# EAGLE design OpIoT_jetson_v_1_4 (EAGLE 9.6.2)
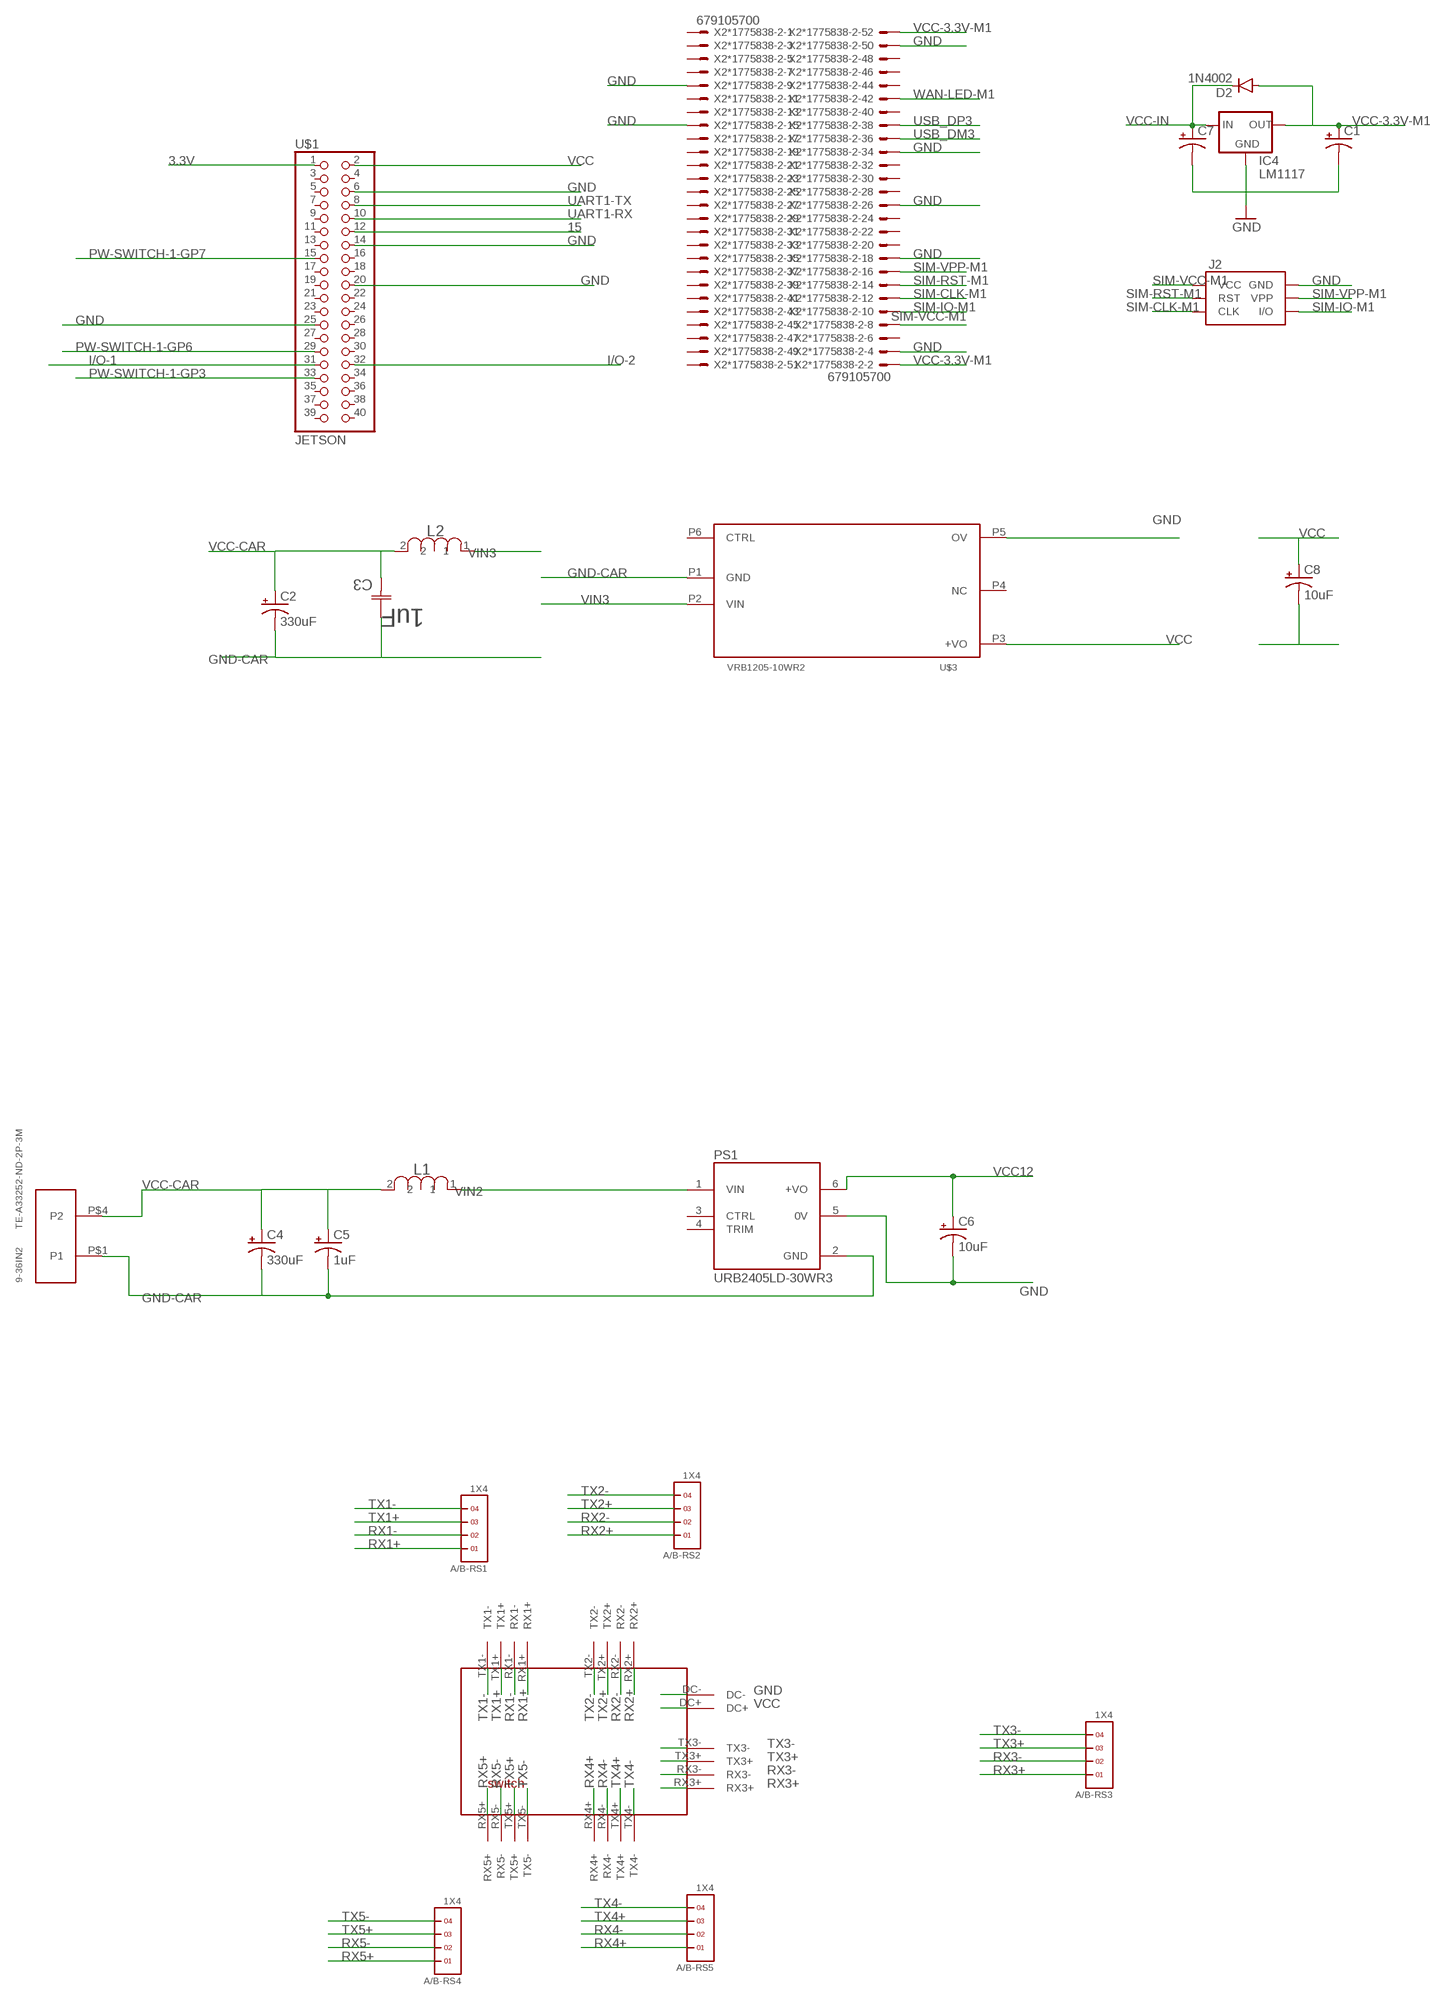
[diagram p0: schematic, sheet 1, part 1 of 2]
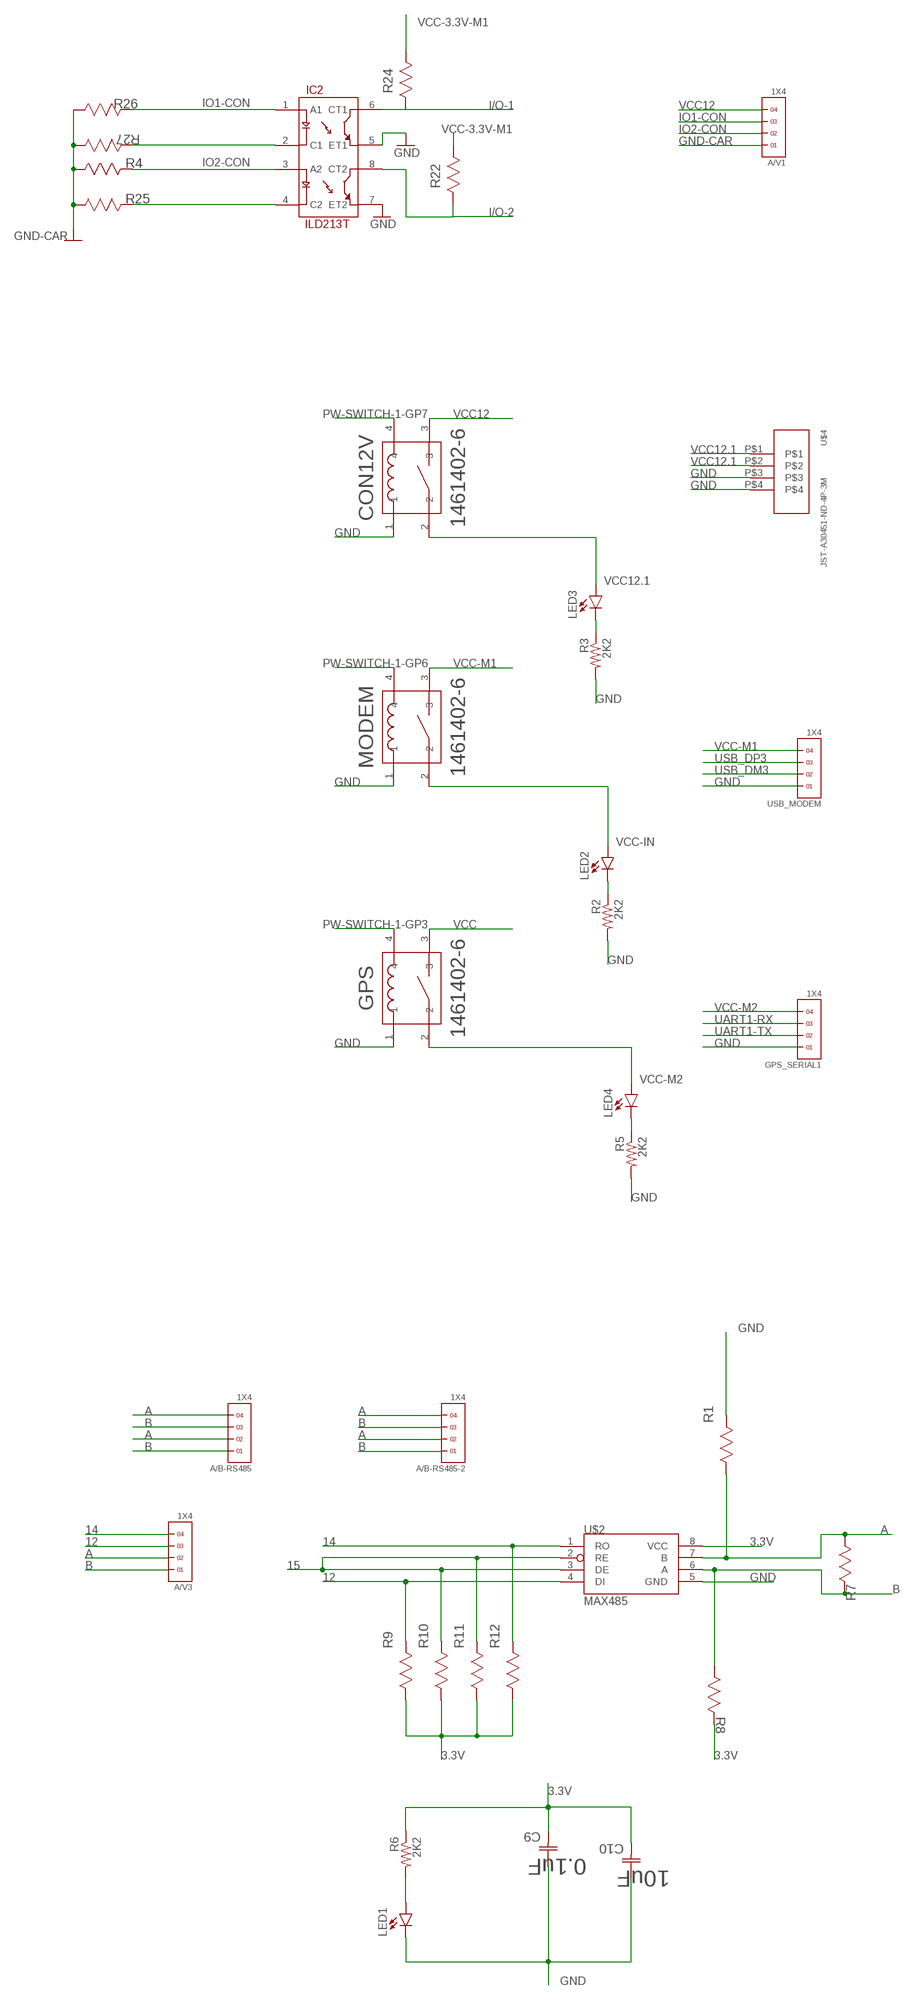
[diagram p1: schematic, sheet 1, part 2 of 2]

## Parts
9-36IN2  TE-A33252-ND-2P-3M  [TE-A33252-ND-2P-3M]
A/B-RS1  1X4  [1X4]
A/B-RS2  1X4  [1X4]
A/B-RS3  1X4  [1X4]
A/B-RS4  1X4  [1X4]
A/B-RS5  1X4  [1X4]
A/B-RS485  1X4  [1X4]
A/B-RS485-2  1X4  [1X4]
A/V1  1X4  [1X4]
A/V3  1X4  [1X4]
C1  CAP_POL1206-KIT  [EIA3216-KIT]
C2  330uF  CPOL-USUD-10X10  [UD-10X10_NICHICON]
C3  1uF  C1206C105K5RACTU  [CAPC3216X110N]
C4  330uF  CPOL-USUD-10X10  [UD-10X10_NICHICON]
C5  1uF  CAP_POL1206-KIT  [EIA3216-KIT]
C6  10uF  CAP_POL1206-KIT  [EIA3216-KIT]
C7  CAP_POL1206-KIT  [EIA3216-KIT]
C8  10uF  CAP_POL1206-KIT  [EIA3216-KIT]
C9  0.1uF  C1206C105K5RACTU  [CAPC3216X110N]
C10  10uF  C1206C105K5RACTU  [CAPC3216X110N]
CON12V  1461402-6  [RELAY_1461402-6]
D2  1N4002  DIODESMA-KIT  [SMA-DIODE-KIT]
GPS  1461402-6  [RELAY_1461402-6]
GPS_SERIAL1  1X4  [1X4]
IC2  ILD213T  [SO08]
IC4  LM1117  [SOT223]
J2  SIMHOLDERSIM  [SIMHOLDER]
L1  4.7uH  PM1210-1R0J-RC  [INDC3225X22N]
L2  4.7uH  PM1210-1R0J-RC  [INDC3225X22N]
LED1  LEDCHIPLED_1206  [CHIPLED_1206]
LED2  LEDCHIPLED_1206  [CHIPLED_1206]
LED3  LEDCHIPLED_1206  [CHIPLED_1206]
LED4  LEDCHIPLED_1206  [CHIPLED_1206]
MODEM  1461402-6  [RELAY_1461402-6]
PS1  URB2405LD-30WR3  [CONV_URB2405LD-30WR3]
R1  20K  ERJ-8ENF1501V  [RESC3216X71N]
R2  2K2  R-US_M1206  [M1206]
R3  2K2  R-US_M1206  [M1206]
R4  4K7  ERJ-8ENF1501V  [RESC3216X71N]
R5  2K2  R-US_M1206  [M1206]
R6  2K2  R-US_M1206  [M1206]
R7  120  ERJ-8ENF1501V  [RESC3216X71N]
R8  20k  ERJ-8ENF1501V  [RESC3216X71N]
R9  10k  ERJ-8ENF1501V  [RESC3216X71N]
R10  10k  ERJ-8ENF1501V  [RESC3216X71N]
R11  10k  ERJ-8ENF1501V  [RESC3216X71N]
R12  10k  ERJ-8ENF1501V  [RESC3216X71N]
R22  300K  ERJ-8ENF1501V  [RESC3216X71N]
R24  300K  ERJ-8ENF1501V  [RESC3216X71N]
R25  2.2K  ERJ-8ENF1501V  [RESC3216X71N]
R26  4K7  ERJ-8ENF1501V  [RESC3216X71N]
R27  2.2K  ERJ-8ENF1501V  [RESC3216X71N]
U$1  JETSON  [2X20]
U$2  MAX485  [SO08]
U$3  VRB1205-10WR2  [MORNSUN-5V]
U$4  JST-A30451-ND-4P-3M  [TE-A30451-4P-TH-3M]
U$6  SWITCH  [JP4]
USB_MODEM  1X4  [1X4]
X2*1775838-2  679105700  [679105700]

## Nets
3.3V: C9.2(C2) C10.2(C2) R6.1 R8.1(R1) R9.2(R2) R10.2(R2) R11.2(R2) R12.2(R2) U$1.1 U$2.8(VCC)
12: A/V3.3 R9.1(R1) U$2.4(DI)
14: A/V3.4 R12.1(R1) U$2.1(RO)
15: R10.1(R1) R11.1(R1) U$1.12 U$2.2(RE) U$2.3(DE)
A: A/B-RS485-2.2 A/B-RS485-2.4 A/B-RS485.2 A/B-RS485.4 A/V3.2 R1.2(R2) R7.1(R1) U$2.7(B)
B: A/B-RS485-2.1 A/B-RS485-2.3 A/B-RS485.1 A/B-RS485.3 A/V3.1 R7.2(R2) R8.2(R2) U$2.6(A)
GND: C1.C(-) C6.C(-) C7.C(-) C8.C(-) C9.1(C1) C10.1(C1) CON12V.1 GPS.1 GPS_SERIAL1.1 IC2.5(ET1) IC2.7(ET2) IC4.1(GND) J2.C5(GND) LED1.C MODEM.1 PS1.5(0V) R1.1(R1) R2.2 R3.2 R5.2 U$1.6 U$1.14 U$1.20 U$1.25 U$2.5(GND) U$3.P5(OV) U$4.P$3 U$4.P$4 U$6.DC- USB_MODEM.1 X2*1775838-2.4 X2*1775838-2.9 X2*1775838-2.15 X2*1775838-2.18 X2*1775838-2.26 X2*1775838-2.34 X2*1775838-2.50
GND-CAR: 9-36IN2.P$1(P1) A/V1.1 C2.- C3.1(C1) C4.- C5.C(-) PS1.2(GND) R4.2(R2) R25.1(R1) R26.2(R2) R27.1(R1) U$3.P1(GND)
I/O-1: IC2.6(CT1) R24.2(R2) U$1.31
I/O-2: IC2.8(CT2) R22.2(R2) U$1.32
IO1-CON: A/V1.3 IC2.1(A1) R26.1(R1)
IO2-CON: A/V1.2 IC2.3(A2) R4.1(R1)
N$2: LED1.A R6.2
N$3: LED2.C R2.1
N$4: LED3.C R3.1
N$5: LED4.C R5.1
N$7: IC2.2(C1) R27.2(R2)
N$9: IC2.4(C2) R25.2(R2)
PW-SWITCH-1-GP3: GPS.4 U$1.33
PW-SWITCH-1-GP6: MODEM.4 U$1.29
PW-SWITCH-1-GP7: CON12V.4 U$1.15
RX1+: A/B-RS1.1 U$6.RX1+
RX1-: A/B-RS1.2 U$6.RX1-
RX2+: A/B-RS2.1 U$6.RX2+
RX2-: A/B-RS2.2 U$6.RX2-
RX3+: A/B-RS3.1 U$6.RX3+
RX3-: A/B-RS3.2 U$6.RX3-
RX4+: A/B-RS5.1 U$6.RX4+
RX4-: A/B-RS5.2 U$6.RX4-
RX5+: A/B-RS4.1 U$6.RX5+
RX5-: A/B-RS4.2 U$6.RX5-
SIM-CLK-M1: J2.C3(CLK) X2*1775838-2.12
SIM-IO-M1: J2.C7(I/O) X2*1775838-2.10
SIM-RST-M1: J2.C2(RST) X2*1775838-2.14
SIM-VCC-M1: J2.C1(VCC) X2*1775838-2.8
SIM-VPP-M1: J2.C6(VPP) X2*1775838-2.16
TX1+: A/B-RS1.3 U$6.TX1+
TX1-: A/B-RS1.4 U$6.TX1-
TX2+: A/B-RS2.3 U$6.TX2+
TX2-: A/B-RS2.4 U$6.TX2-
TX3+: A/B-RS3.3 U$6.TX3+
TX3-: A/B-RS3.4 U$6.TX3-
TX4+: A/B-RS5.3 U$6.TX4+
TX4-: A/B-RS5.4 U$6.TX4-
TX5+: A/B-RS4.3 U$6.TX5+
TX5-: A/B-RS4.4 U$6.TX5-
UART1-RX: GPS_SERIAL1.3 U$1.10
UART1-TX: GPS_SERIAL1.2 U$1.8
USB_DM3: USB_MODEM.2 X2*1775838-2.36
USB_DP3: USB_MODEM.3 X2*1775838-2.38
VCC: C8.A(+) GPS.3 U$1.2 U$3.P3(+VO) U$6.DC+
VCC12: A/V1.4 C6.A(+) CON12V.3 PS1.6(+VO)
VCC12.1: CON12V.2 LED3.A U$4.P$1 U$4.P$2
VCC-3.3V-M1: C1.A(+) D2.A IC4.2(OUT) R22.1(R1) R24.1(R1) X2*1775838-2.2 X2*1775838-2.52
VCC-CAR: 9-36IN2.P$4(P2) C2.+ C3.2(C2) C4.+ C5.A(+) L1.2 L2.2
VCC-IN: C7.A(+) D2.C IC4.3(IN) LED2.A MODEM.2
VCC-M1: MODEM.3 USB_MODEM.4
VCC-M2: GPS.2 GPS_SERIAL1.4 LED4.A
VIN2: L1.1 PS1.1(VIN)
VIN3: L2.1 U$3.P2(VIN)
WAN-LED-M1: X2*1775838-2.42
Unconnected: PS1.3(CTRL) PS1.4(TRIM) U$1.3 U$1.4 U$1.5 U$1.7 U$1.9 U$1.11 U$1.13 U$1.16 U$1.17 U$1.18 U$1.19 U$1.21 U$1.22 U$1.23 U$1.24 U$1.26 U$1.27 U$1.28 U$1.30 U$1.34 U$1.35 U$1.36 U$1.37 U$1.38 U$1.39 U$1.40 U$3.P4(NC) U$3.P6(CTRL) X2*1775838-2.1 X2*1775838-2.3 X2*1775838-2.5 X2*1775838-2.6 X2*1775838-2.7 X2*1775838-2.11 X2*1775838-2.13 X2*1775838-2.17 X2*1775838-2.19 X2*1775838-2.20 X2*1775838-2.21 X2*1775838-2.22 X2*1775838-2.23 X2*1775838-2.24 X2*1775838-2.25 X2*1775838-2.27 X2*1775838-2.28 X2*1775838-2.29 X2*1775838-2.30 X2*1775838-2.31 X2*1775838-2.32 X2*1775838-2.33 X2*1775838-2.35 X2*1775838-2.37 X2*1775838-2.39 X2*1775838-2.40 X2*1775838-2.41 X2*1775838-2.43 X2*1775838-2.44 X2*1775838-2.45 X2*1775838-2.46 X2*1775838-2.47 X2*1775838-2.48 X2*1775838-2.49 X2*1775838-2.51

## Library data of the parts
9-36IN2 = MonkeyTech:TE-A33252-ND-2P-3M
A/B-RS1-A/B-RS5 A/B-RS485 A/B-RS485-2 A/V1 A/V3 GPS_SERIAL1 USB_MODEM = headers(2mm):1X4
C1 C5-C8 = SparkFun-Passives:CAP_POL: Capacitor Polarized These are standard SMD and PTH capacitors. Normally 10uF, 47uF, and 100uF in electrolytic and tantalum varieties. Always verify the external diameter of the through hole cap, it varies with capacity, voltage, and manufacturer. The EIA devices should be standard.
C2 C4 = rcl:CPOL-US: POLARIZED CAPACITOR, American symbol; SPICEPREFIX: C
C3 = Kemet_By_element14_Batch_1:C1206C105K5RACTU: CAPACITOR, 1206; MPN: C1206C105K5RACTU; OC_FARNELL: 1288207; OC_NEWARK: 93K6006; SUPPLIER: Kemet; TOLERANCE: ±10%; VOLTAGERATING: 50V
C9 C10 = Kemet_By_element14_Batch_1:C1206C105K5RACTU: CAPACITOR, 1206; MPN: C1206C105K5RACTU; OC_FARNELL: 1288207; OC_NEWARK: 93K6006; SUPPLIER: Kemet; TOLERANCE: ±10%; VALUE: 1uF; VOLTAGERATING: 50V
CON12V GPS MODEM = 1461402-6:1461402-6: Electromechanical Relay 12VDC 320Ohm 10A SPST-NO (( 18.2mm 10.2mm 14.7mm)) THT Industrial Relay Check prices <https://pricing.snapeda.com/search/part/OJE-SH-112HM%2C000/?ref=eda>; AVAILABILITY: Warning; COMMENT: 1461402-6; DESCRIPTION: Electromechanical Relay 12VDC 320Ohm 10A SPST-NO (( 18.2mm 10.2mm 14.7mm)) THT Industrial Relay; MF: TE Connectivity; MP: OJE-SH-112HM,000; PACKAGE: None; PRICE: None; PURCHASE-URL: https://pricing.snapeda.com/search/part/OJE-SH-112HM,000/?ref=eda
D2 = SparkFun-DiscreteSemi:DIODE: Diode These are standard reverse protection diodes and small signal diodes. SMA package can handle up to about 1A. SOD-323 can handle about 200mA. What the SOD-323 package when ordering, there are some mfgs out there that are 5-pin packages.
IC2 = SparkFun-DiscreteSemi:ILD213T: Dual optoisolator.
IC4 = LM1117:LM1117; AVAILABILITY: Good; DESCRIPTION: Voltage stabiliser; LDO, fixed; 3.3V; 0.8A; SOT223; SMD; MF: Texas Instruments; MP: LM1117MP-3.3/NOPB; PACKAGE: SOT-223 Texas Instruments; PRICE: 0.61 USD
J2 = SparkFun-Connectors:SIMHOLDER: SIM Socket Socket for SIM cellular cards. Schematic element and footprint production proven. Spark Fun Electronics SKU : PRT-00548; PROD_ID: CONN-08536
L1 L2 = Bourns_By_element14_Batch_1:PM1210-1R0J-RC: CHIP INDUCTOR, 1UH, 400MA 5% 120MHZ; MPN: PM1210-1R0J-RC; OC_FARNELL: 1180462; OC_NEWARK: 63K3090; SUPPLIER: BOURNS; TOLERANCE: ±5 %; VALUE: 1.0 uH
LED1-LED4 = led:LED: LED OSRAM: - CHIPLED LG R971, LG N971, LY N971, LG Q971, LY Q971, LO R971, LY R971 LH N974, LH R974 LS Q976, LO Q976, LY Q976 LO Q996 - Hyper CHIPLED LW Q18S LB Q993, LB Q99A, LB R99A - SideLED LS A670, LO A670, LY A670, LG A670, LP A670 LB A673, LV A673, LT A673, LW A673 LH A674 LY A675 LS A676, LA A676, LO A676, LY A676, LW A676 LS A679, LY A679, LG A679 - Hyper Micro SIDELED® LS Y876, LA Y876, LO Y876, LY Y876 LT Y87S - SmartLED LW L88C, LW L88S LB L89C, LB L89S, LG L890 LS L89K, LO L89K, LY L89K LS L896, LA L896, LO L896, LY L896 - TOPLED LS T670, LO T670, LY T670, LG T670, LP T670 LSG T670, LSP T670, LSY T670, LOP T670, LYG T670 LG T671, LOG T671, LSG T671 LB T673, LV T673, LT T673, LW T673 LH T674 LS T676, LA T676, LO T676, LY T676, LB T676, LH T676, LSB T676, LW T676 LB T67C, LV T67C, LT T67C, LS T67K, LO T67K, LY T67K, LW E67C LS E67B, LA E67B, LO E67B, LY E67B, LB E67C, LV E67C, LT E67C LW T67C LS T679, LY T679, LG T679 LS T770, LO T770, LY T770, LG T770, LP T770 LB T773, LV T773, LT T773, LW T773 LH T774 LS E675, LA E675, LY E675, LS T675 LS T776, LA T776, LO T776, LY T776, LB T776 LHGB T686 LT T68C, LB T68C - Hyper Mini TOPLED® LB M676 - Mini TOPLED Santana® LG M470 LS M47K, LO M47K, LY M47K Source: http://www.osram.convergy.de LUXEON: - LUMILED® LXK2-PW12-R00, LXK2-PW12-S00, LXK2-PW14-U00, LXK2-PW14-V00 LXK2-PM12-R00, LXK2-PM12-S00, LXK2-PM14-U00 LXK2-PE12-Q00, LXK2-PE12-R00, LXK2-PE12-S00, LXK2-PE14-T00, LXK2-PE14-U00 LXK2-PB12-K00, LXK2-PB12-L00, LXK2-PB12-M00, LXK2-PB14-N00, LXK2-PB14-P00, LXK2-PB14-Q00 LXK2-PR12-L00, LXK2-PR12-M00, LXK2-PR14-Q00, LXK2-PR14-R00 LXK2-PD12-Q00, LXK2-PD12-R00, LXK2-PD12-S00 LXK2-PH12-R00, LXK2-PH12-S00 LXK2-PL12-P00, LXK2-PL12-Q00, LXK2-PL12-R00 Source: www.luxeon.com KINGBRIGHT: KA-3528ASYC Source: www.kingbright.com
PS1 = URB2405LD-30WR3:URB2405LD-30WR3: URB_LD-30WR3 series are isolated 30W DC-DC products with 4:1 input voltage; AVAILABILITY: Unavailable; DESCRIPTION: URB_LD-30WR3 series are isolated 30W DC-DC products with 4:1 input voltage; MF: MORNSUN; MP: URB2405LD-30WR3; PACKAGE: Package; PRICE: None
R1 R4 R7-R12 R22 R24-R27 = Panasonic_By_element14_Batch_1:ERJ-8ENF1501V: RESISTOR, 1206; MPN: ERJ-8ENF1501V; OC_FARNELL: 1748434; OC_NEWARK: 64R5441; SUPPLIER: Panasonic; TOLERANCE: ±1 %; VALUE: 1.5 KOhm; WATTAGE: 0.25 W
R2 R3 R5 R6 = rcl:R-US_: RESISTOR, American symbol; SPICEPREFIX: R
U$1 = Jetson:JETSON
U$2 = MAX485:MAX485; AVAILABILITY: Unavailable; DESCRIPTION: 1/1 Transceiver Half RS422, RS485 8-uMAX; MF: Maxim Integrated; MP: MAX485; PACKAGE: SOIC-8 Maxim Integrated; PRICE: None
U$3 = MonkeyTech:VRB1205-10WR2
U$4 = MonkeyTech:JST-A30451-ND-4P-3M
U$6 = switch2:SWITCH
X2*1775838-2 = con-molex:679105700: MINI PCI EXPRESS CONNECTOR 0.8MM PITCH, 52 CIRCUIT Source: http://www.molex.com/pdm_docs/sd/679105700_sd.pdf; MF: MOLEX; MPN: 67910-5700; OC_FARNELL: unknown; OC_NEWARK: 93M2128

## Net classes
1 power: width 0.305 mm

## Board
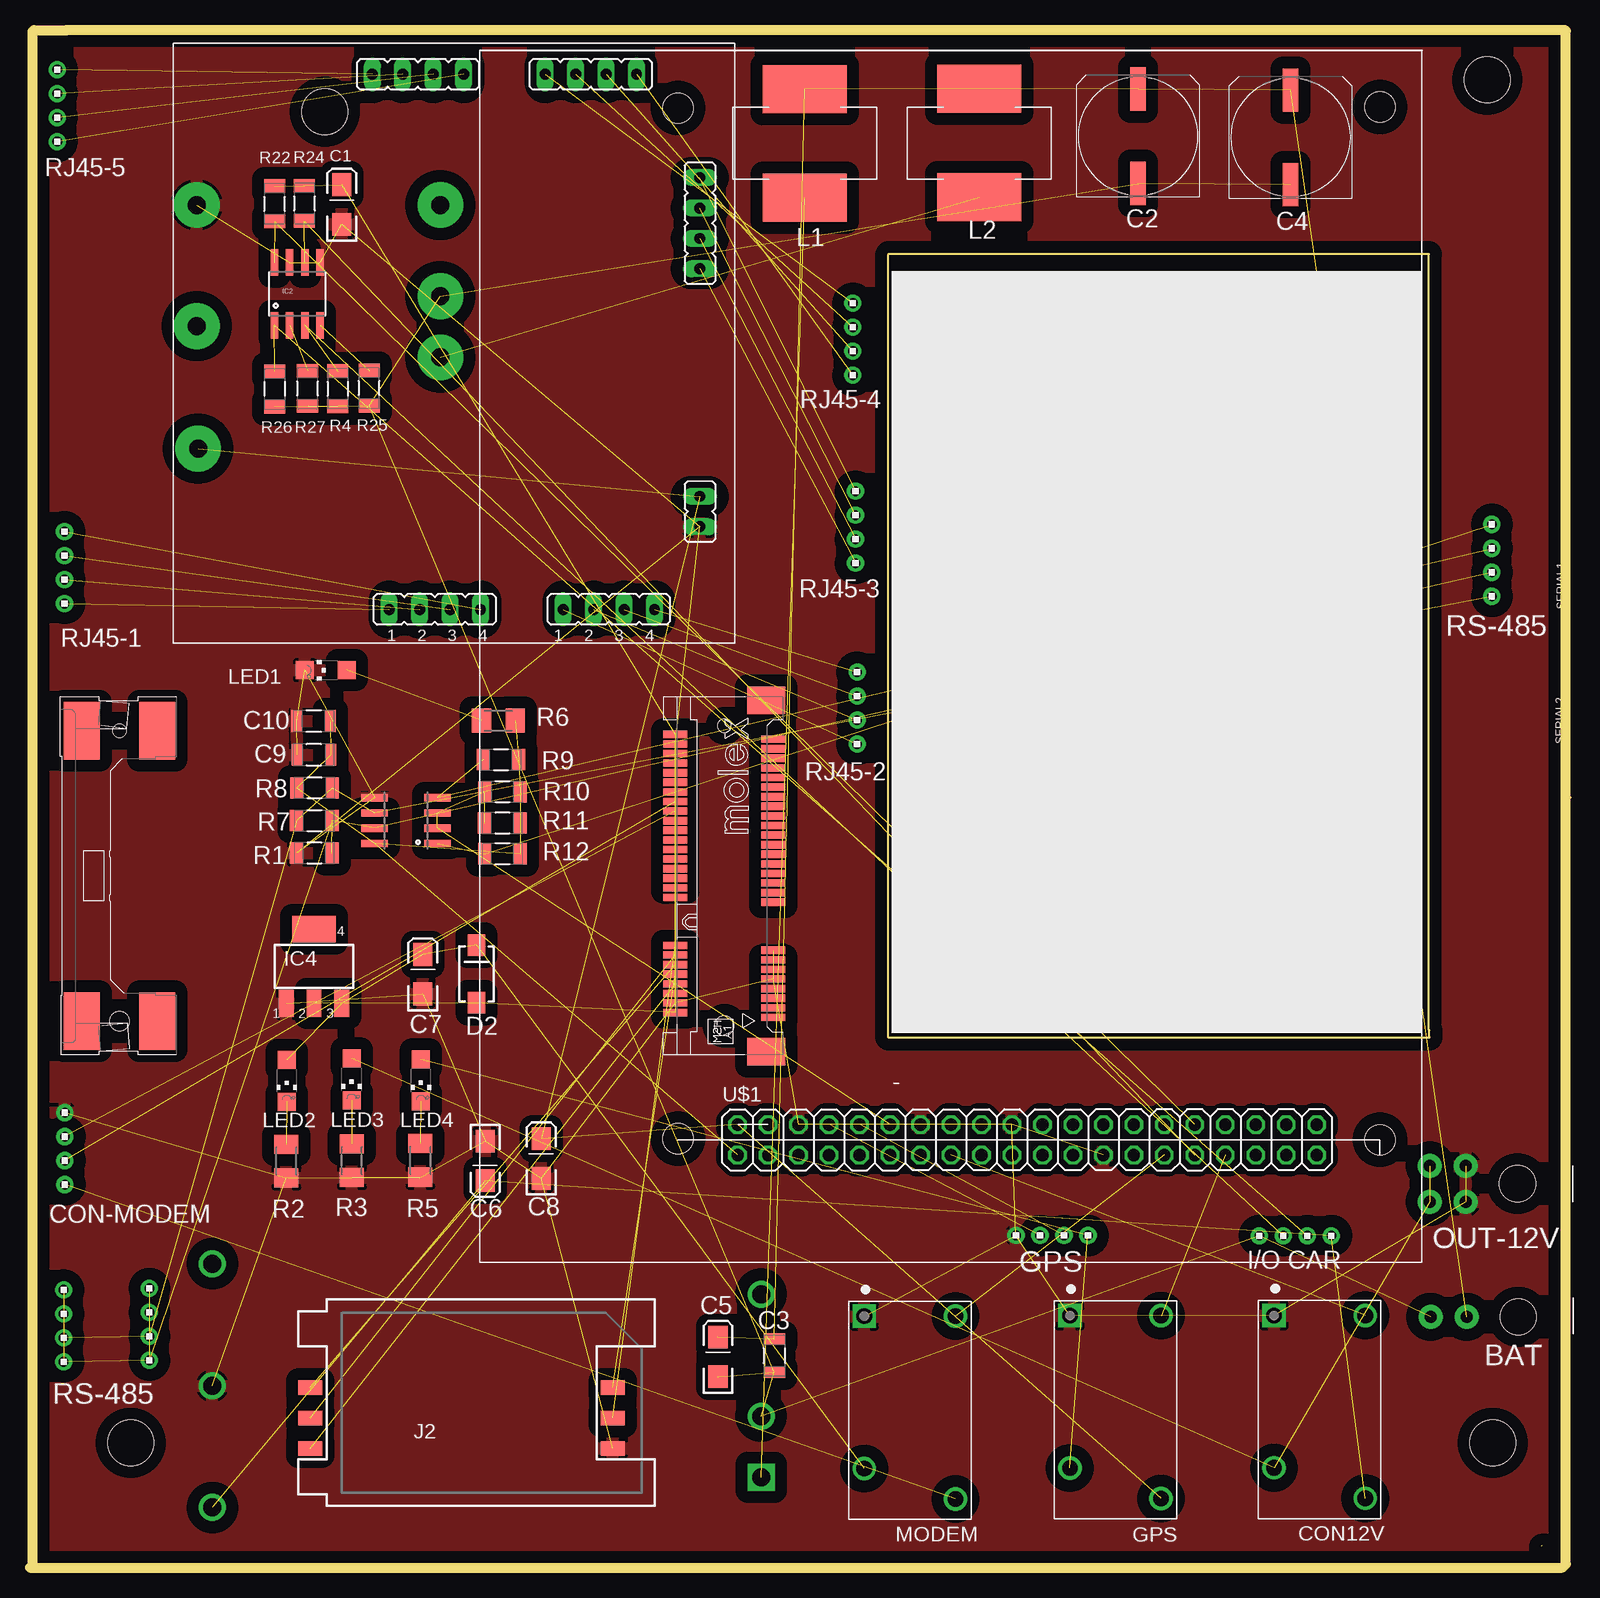
[diagram p2: board, top side]
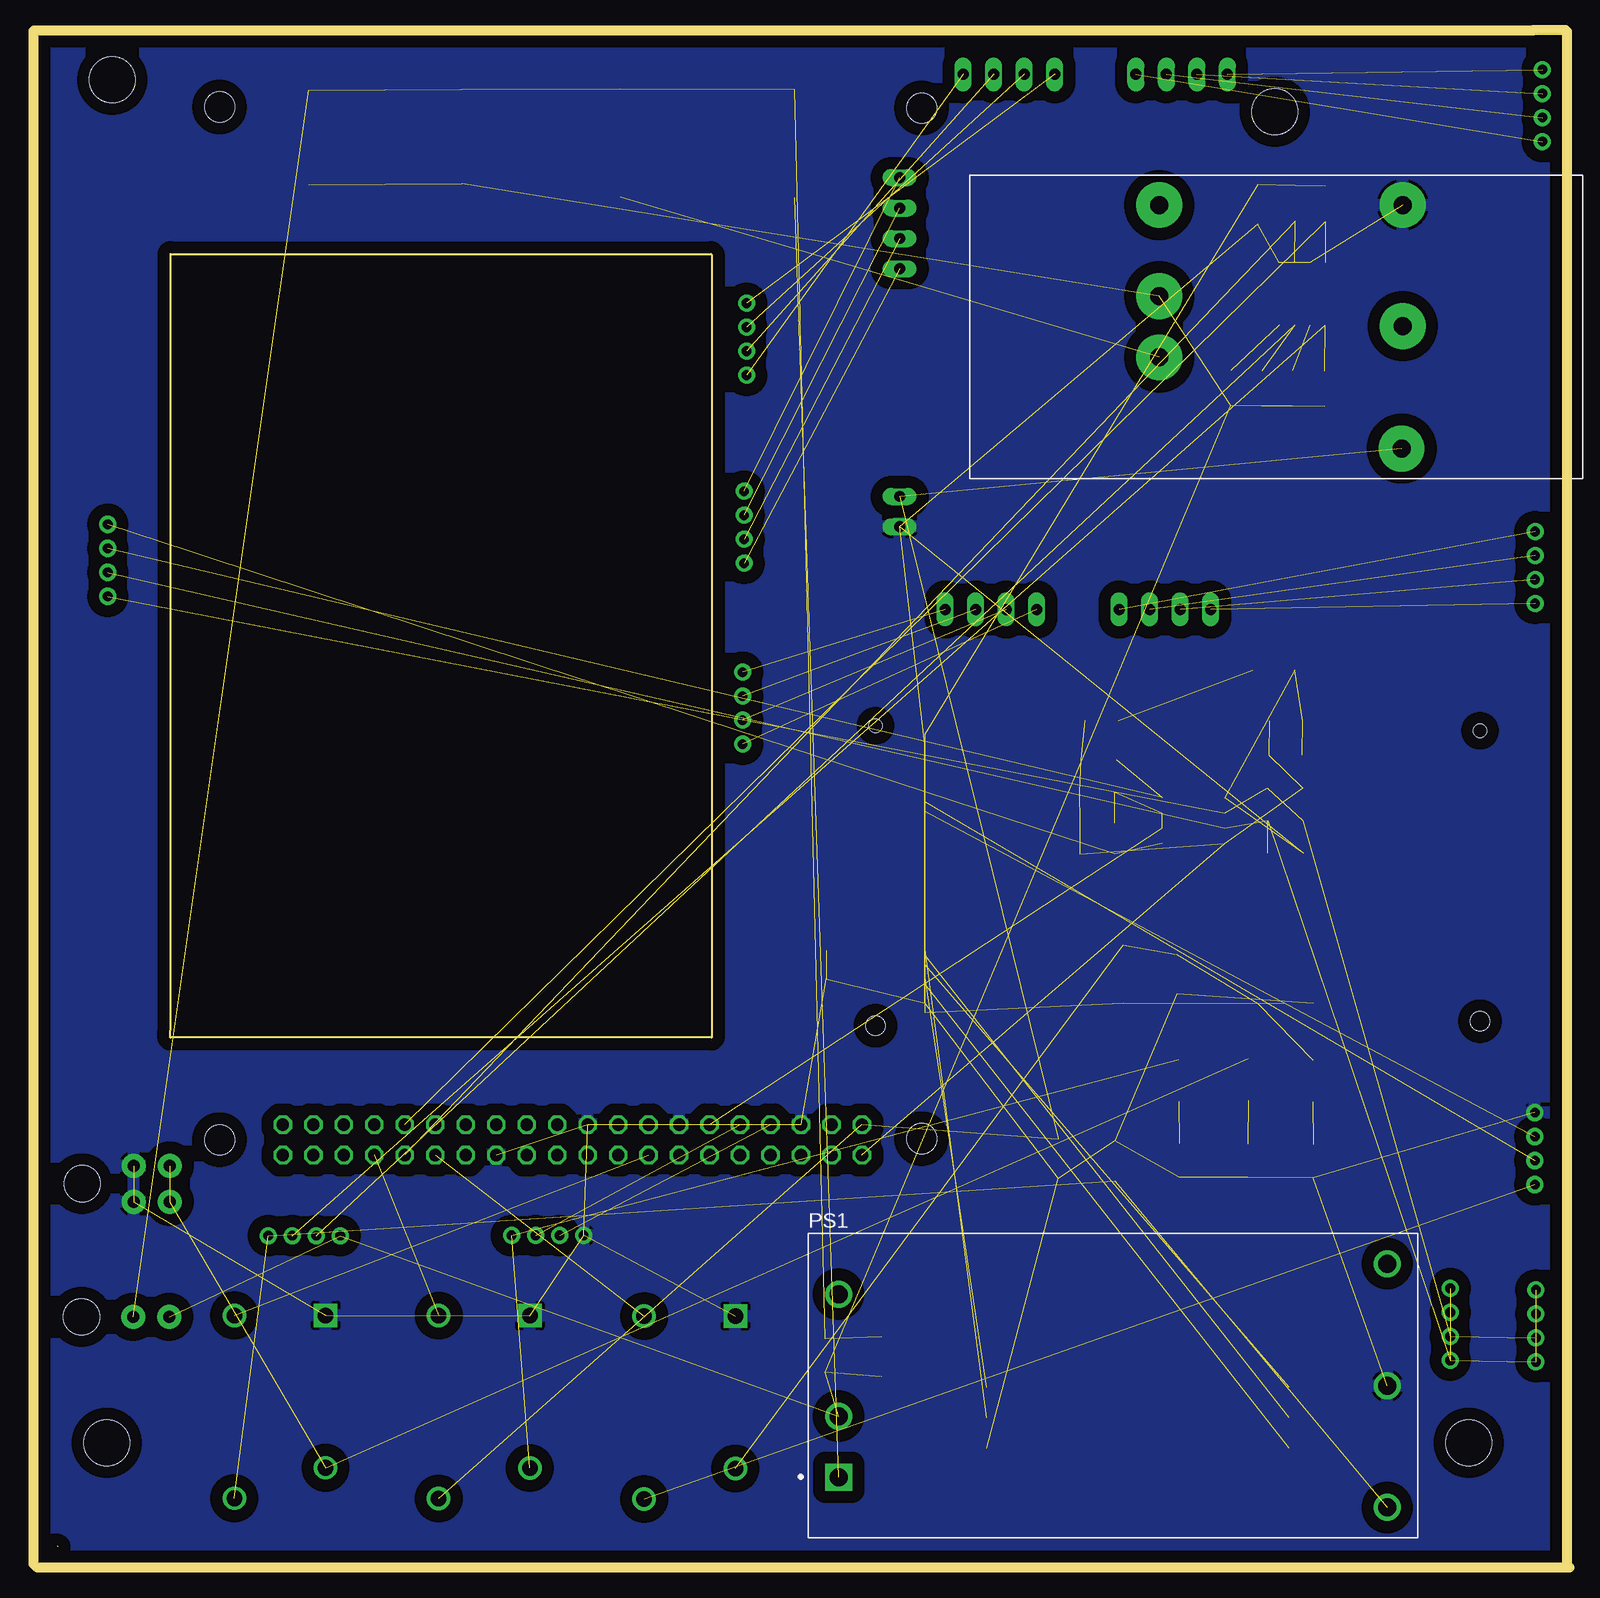
[diagram p3: board, bottom side, seen from below]

Size 128.3 x 128.18 mm. Coordinates in mm from the lower left corner, seen from the top.
Outline: 128.3,64.19 128.12,64.37
Outline: 116.58,44.81 116.58,109.48 116.6,109.5 71.56,109.5 71.49,109.42 71.49,44.23 71.52,44.2 116.61,44.2 116.64,44.23 116.6,44.27 116.6,44.8
Outline: 126.01,1.84 125.94,1.77
Outline: 0,0 127.69,0 128,0.3 128,128.11 127.96,128.15 3.04,128.15 3.02,128.16
Outline: 0.21,0 0.21,128.05 0.35,128.18 3.05,128.18
Copper layers (1*16): Top 0.035mm / dielectric 1.6mm / Bottom 0.035mm
Design rules "Check_Rule_Microcircuitos": minimum track width 0.25mm, minimum drill 0.4mm, track to track 0.25mm, track to pad 0.25mm, pad to pad 0.25mm, via to via 0.25mm, smd to smd 0mil, copper to edge 0.6mm, drill to drill 0.4mm, minimum pad ring 0.25mm, minimum via ring 0.25mm, stop-mask expansion 0mil, vias tented up to drill 0.4mm, thermal gap 0.25mm
Holes 3.81 mm at 121.9,10.41 8.39,10.41 24.57,121.38 121.45,124.05

### Footprints (pad centres in the part's own frame; a part is rotated, then mirrored left to right if it is on the bottom)
TE-A33252-ND-2P-3M = drill 1 pad 2: P$1 -0.23,-1.14; P$4 -0.23,-4.14 | hole 3: -0.23,-8.44
1X4 = drill 0.8 pad 1.422: 1 -3,0; 2 -1,0; 3 1,0; 4 3,0
EIA3216-KIT = smd 1.9 x 1.6: A 1.65,0; C -1.65,0
UD-10X10_NICHICON = smd 3.6 x 1.3: + 3.925,0; - -3.95,0
CAPC3216X110N = smd 0.914 x 1.803: 1 -1.397,0; 2 1.397,0
RELAY_1461402-6 = drill 1.3 square: 1 -7.62,-3.8 | drill 1.3: 2 5.08,-3.8; 3 7.62,3.8; 4 -7.62,3.8
SMA-DIODE-KIT = smd 1.77 x 1.47: A -2.4,0; C 2.4,0
SO08 = smd 0.61 x 2.21: 1 -1.905,-2.616; 2 -0.635,-2.616; 3 0.635,-2.616; 4 1.905,-2.616; 5 1.905,2.616; 6 0.635,2.616; 7 -0.635,2.616; 8 -1.905,2.616
SOT223 = smd 1.219 x 2.235: 1 -2.311,-3.099; 2 0,-3.099; 3 2.311,-3.099 | smd 3.6 x 2.2: 4 0,3.099
SIMHOLDER = smd 2 x 1.2: C1 -12.61,-3.81; C2 -12.61,-1.27; C3 -12.61,1.27; C5 12.61,-3.81; C6 12.61,-1.27; C7 12.61,1.27
INDC3225X22N = smd 4 x 7: 1 -0.524,0; 2 8.524,0
CHIPLED_1206 = smd 1.5 x 1.5: A 0,-1.75; C 0,1.75
CONV_URB2405LD-30WR3 = drill 1.5 square: 1 -22.86,-7.62 | drill 1.5: 2 -22.86,-2.54; 3 -22.86,7.62; 4 22.86,10.16; 5 22.86,0; 6 22.86,-10.16
RESC3216X71N = smd 1.118 x 1.753: 1 -1.473,0; 2 1.473,0
M1206 = smd 1.6 x 2: 1 -1.4,0; 2 1.4,0
2X20 = drill 1.016 octagon: 1 -28.53,0.93; 2 -28.53,3.47; 3 -25.99,0.93; 4 -25.99,3.47; 5 -23.45,0.93; 6 -23.45,3.47; 7 -20.91,0.93; 8 -20.91,3.47; 9 -18.37,0.93; 10 -18.37,3.47; 11 -15.83,0.93; 12 -15.83,3.47; 13 -13.29,0.93; 14 -13.29,3.47; 15 -10.75,0.93; 16 -10.75,3.47; 17 -8.21,0.93; 18 -8.21,3.47; 19 -5.67,0.93; 20 -5.67,3.47; 21 -3.13,0.93; 22 -3.13,3.47; 23 -0.59,0.93; 24 -0.59,3.47; 25 1.95,0.93; 26 1.95,3.47; 27 4.49,0.93; 28 4.49,3.47; 29 7.03,0.93; 30 7.03,3.47; 31 9.57,0.93; 32 9.57,3.47; 33 12.11,0.93; 34 12.11,3.47; 35 14.65,0.93; 36 14.65,3.47; 37 17.19,0.93; 38 17.19,3.47; 39 19.73,0.93; 40 19.73,3.47 | hole 2.5: 25,2.2; -33.5,2.3; -33.5,2.3; 25,88.3; -33.5,88.2
MORNSUN-5V = drill 1.5 pad 3.81: P1 -10.4,2.3; P2 -10.4,-2.8; P3 9.8,-10.4; P4 9.9,-0.2; P5 9.9,9.9; P6 -10.4,9.9
TE-A30451-4P-TH-3M = drill 1 pad 2: P$1 -1.5,-1.3; P$2 1.5,-1.3; P$3 1.5,-4.3; P$4 -1.5,-4.3 | hole 3: 0,-8.6
JP4 = drill 0.914 long: DC+ 24.3,9.43; DC- 24.3,6.89; RX1+ 6.01,0; RX1- 3.47,0; RX2+ 20.51,0; RX2- 17.97,0; RX3+ 24.3,28.39; RX3- 24.3,30.93; RX4+ 11.39,44.6; RX4- 13.93,44.6; RX5+ -3.01,44.6; RX5- -0.47,44.6; TX1+ 0.93,0; TX1- -1.61,0; TX2+ 15.43,0; TX2- 12.89,0; TX3+ 24.3,33.47; TX3- 24.3,36.01; TX4+ 16.47,44.6; TX4- 19.01,44.6; TX5+ 2.07,44.6; TX5- 4.61,44.6
679105700 = smd 0.6 x 2: 1 0.7,-4.1; 2 1.1,4.1; 3 1.5,-4.1; 4 1.9,4.1; 5 2.3,-4.1; 6 2.7,4.1; 7 3.1,-4.1; 8 3.5,4.1; 9 3.9,-4.1; 10 4.3,4.1; 11 4.7,-4.1; 12 5.1,4.1; 13 5.5,-4.1; 14 5.9,4.1; 15 6.3,-4.1; 16 6.7,4.1; 17 10.3,-4.1; 18 10.7,4.1; 19 11.1,-4.1; 20 11.5,4.1; 21 11.9,-4.1; 22 12.3,4.1; 23 12.7,-4.1; 24 13.1,4.1; 25 13.5,-4.1; 26 13.9,4.1; 27 14.3,-4.1; 28 14.7,4.1; 29 15.1,-4.1; 30 15.5,4.1; 31 15.9,-4.1; 32 16.3,4.1; 33 16.7,-4.1; 34 17.1,4.1; 35 17.5,-4.1; 36 17.9,4.1; 37 18.3,-4.1; 38 18.7,4.1; 39 19.1,-4.1; 40 19.5,4.1; 41 19.9,-4.1; 42 20.3,4.1; 43 20.7,-4.1; 44 21.1,4.1; 45 21.5,-4.1; 46 21.9,4.1; 47 22.3,-4.1; 48 22.7,4.1; 49 23.1,-4.1; 50 23.5,4.1; 51 23.9,-4.1; 52 24.3,4.1 | smd 2.3 x 3.2: M1 27.15,-3.5; M2 -2.15,-3.5 | smd 4.8 x 3: M3 0.4,47.25; M4 0.4,53.55; M5 24.6,47.25; M6 24.6,53.55 | hole 1.6: 0,0; 0.4,50.4 | hole 1.1: 25,0; 24.6,50.4

### Placement (x,y rotation side)
9-36IN2  115.58,21.14 90 top
A/B-RS1  2.87,83.37 270 top
A/B-RS2  68.92,71.65 270 top
A/B-RS3  68.79,86.73 90 top
A/B-RS4  2.27,121.88 270 top
A/B-RS5  68.58,102.41 270 top
A/B-RS485  9.95,20.29 270 top
A/B-RS485-2  2.81,20.16 270 top
A/V1  105.45,27.67 0 top
A/V3  121.82,83.97 90 top
C1  25.98,113.63 90 top
C2  92.34,119.34 90 top
C3  62.03,17.69 90 top
C4  105.05,119.24 90 top
C5  57.33,17.58 90 top
C6  37.92,33.91 270 top
C7  32.74,49.47 90 top
C8  42.59,34.11 90 top
C9  23.66,67.76 0 top
C10  23.64,70.57 0 top
CON12V  107.47,13.41 270 top
D2  37.21,49.5 90 top
GPS  90.45,13.39 270 top
GPS_SERIAL1  85.16,27.7 0 top
IC2  22.27,106.18 0 top
IC4  23.67,50.12 0 top
J2  35.97,13.75 0 top
L1  64.56,114.73 90 top
L2  79.09,114.76 90 top
LED1  24.66,74.81 90 top
LED2  21.4,40.6 180 top
LED3  26.8,40.7 180 top
LED4  32.57,40.61 180 top
MODEM  73.32,13.35 270 top
PS1  38.06,15.18 0 bottom
R1  23.69,59.57 0 top
R2  21.36,33.9 270 top
R3  26.82,33.92 270 top
R4  25.66,98.28 270 top
R5  32.54,33.96 270 top
R6  39.03,70.61 180 top
R7  23.69,62.27 180 top
R8  23.71,65 0 top
R9  39.25,67.35 0 top
R10  39.38,64.68 0 top
R11  39.36,62.08 0 top
R12  39.37,59.52 0 top
R22  20.38,113.69 270 top
R24  22.87,113.73 270 top
R25  28.25,98.33 90 top
R26  20.39,98.25 270 top
R27  23.12,98.3 90 top
U$1  87.5,33.47 0 top
U$2  31.34,62.28 90 top
U$3  23.8,103.69 0 bottom
U$4  115.36,32.01 90 top
U$6  31.53,79.88 0 top
USB_MODEM  2.9,34.93 270 top
X2*1775838-2  57.86,45.17 90 top

### Tracks (layer width: path | path; a pad name or v marks a point on that pad's centre or on a via)
3.3V  (9 unrouted)
12  (2 unrouted)
14  (2 unrouted)
15  (4 unrouted)
A  (7 unrouted)
B  (7 unrouted)
GND  (36 unrouted)
  pour Bottom (isolate 1.016): 1.5,125.75 1.5,1.23 2.29,0.44 126.66,0.44 126.66,127.28 3.03,127.28
  pour Top (isolate 1.016): 1.39,127.01 60.11,127.01 60.23,127.13 126.71,127.13 126.71,0.32 1.39,0.32
GND-CAR  (11 unrouted)
I/O-1  (2 unrouted)
I/O-2  (2 unrouted)
IO1-CON  (2 unrouted)
IO2-CON  (2 unrouted)
N$2  (1 unrouted)
N$3  (1 unrouted)
N$4  (1 unrouted)
N$5  (1 unrouted)
N$7  (1 unrouted)
N$9  (1 unrouted)
PW-SWITCH-1-GP3  (1 unrouted)
PW-SWITCH-1-GP6  (1 unrouted)
PW-SWITCH-1-GP7  (1 unrouted)
RX1+  (1 unrouted)
RX1-  (1 unrouted)
RX2+  (1 unrouted)
RX2-  (1 unrouted)
RX3+  (1 unrouted)
RX3-  (1 unrouted)
RX4+  (1 unrouted)
RX4-  (1 unrouted)
RX5+  (1 unrouted)
RX5-  (1 unrouted)
SIM-CLK-M1  (1 unrouted)
SIM-IO-M1  (1 unrouted)
SIM-RST-M1  (1 unrouted)
SIM-VCC-M1  (1 unrouted)
SIM-VPP-M1  (1 unrouted)
TX1+  (1 unrouted)
TX1-  (1 unrouted)
TX2+  (1 unrouted)
TX2-  (1 unrouted)
TX3+  (1 unrouted)
TX3-  (1 unrouted)
TX4+  (1 unrouted)
TX4-  (1 unrouted)
TX5+  (1 unrouted)
TX5-  (1 unrouted)
UART1-RX  (1 unrouted)
UART1-TX  (1 unrouted)
USB_DM3  (1 unrouted)
USB_DP3  (1 unrouted)
VCC  (4 unrouted)
VCC12  (3 unrouted)
VCC12.1  (3 unrouted)
VCC-3.3V-M1  (6 unrouted)
VCC-CAR  (6 unrouted)
VCC-IN  (4 unrouted)
VCC-M1  (1 unrouted)
VCC-M2  (2 unrouted)
VIN2  (1 unrouted)
VIN3  (1 unrouted)

### Text on the board
tPlace: SERIAL1 | SERIAL2
tNames: RJ45-5 | RJ45-4 | RJ45-3 | RS-485 | RJ45-1 | RJ45-2 | CON-MODEM | OUT-12V | GPS | I/O CAR | BAT | RS-485